# Altium schematic sheet Modules_And_Sensors.SchDoc
size B; SheetNumber: 1; SheetTotal: 2
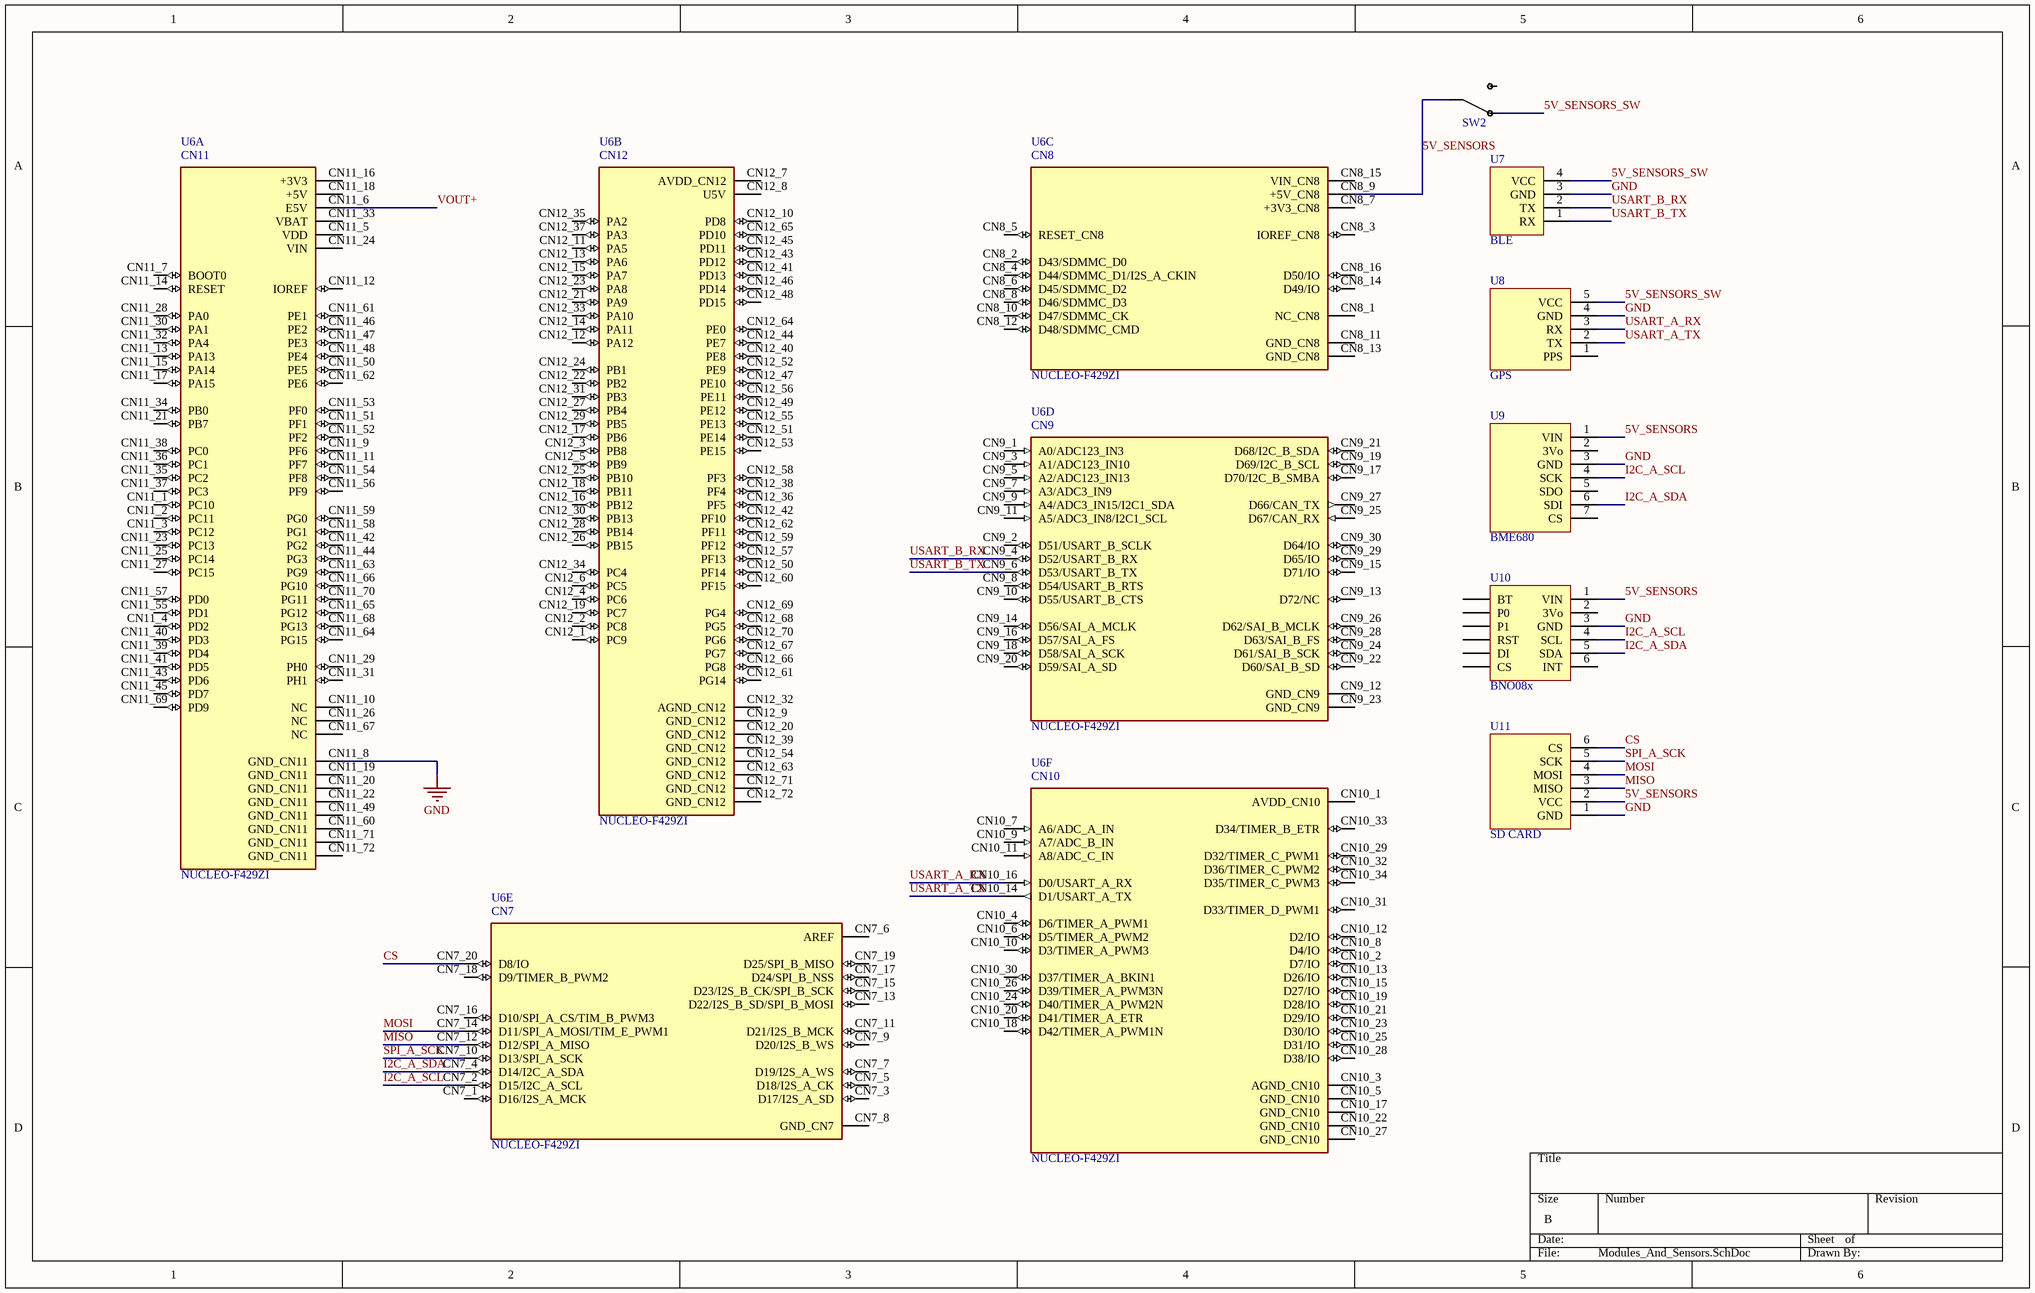
[diagram p0: Modules_And_Sensors.SchDoc]

## Parts
SW2  SW  [SWITCH]  (value not drawn)
U6  NUCLEO-F429ZI  [MODULE_NUCLEO-F429ZI]  (parts A,B,C,D,E,F of 6)
U7  BLE  [BLE]
U8  GPS  [GPS]
U9  BME680  [BME680]
U10  BNO08x  [BNO08x]
U11  SD CARD  [SD CARD]

## Nets
GND: U6.CN11_8(GND_CN11) U7.3(GND) U8.4(GND) U9.3(GND) U10.3(GND) U11.1(GND)
5V_SENSORS: SW2.2 U6.CN8_9(+5V_CN8) U9.1(VIN) U10.1(VIN) U11.2(VCC)
5V_SENSORS_SW: SW2.1 U7.4(VCC) U8.5(VCC)
CS: U6.CN7_20(D8/IO) U11.6(CS)
I2C_A_SCL: U6.CN7_2(D15/I2C_A_SCL) U9.4(SCK) U10.4(SCL)
I2C_A_SDA: U6.CN7_4(D14/I2C_A_SDA) U9.6(SDI) U10.5(SDA)
MISO: U6.CN7_12(D12/SPI_A_MISO) U11.3(MISO)
MOSI: U6.CN7_14(D11/SPI_A_MOSI/TIM_E_PWM1) U11.4(MOSI)
SPI_A_SCK: U6.CN7_10(D13/SPI_A_SCK) U11.5(SCK)
USART_A_RX: U6.CN10_16(D0/USART_A_RX) U8.3(RX)
USART_A_TX: U6.CN10_14(D1/USART_A_TX) U8.2(TX)
USART_B_RX: U6.CN9_4(D52/USART_B_RX) U7.2(TX)
USART_B_TX: U6.CN9_6(D53/USART_B_TX) U7.1(RX)
VOUT+: U6.CN11_6(E5V)

Not connected (* = marked no-connect by the designer): SW2 3(6); U6 CN7_1(D16/I2S_A_MCK) CN7_3(D17/I2S_A_SD) CN7_5(D18/I2S_A_CK) CN7_6(AREF) CN7_7(D19/I2S_A_WS) CN7_8(GND_CN7) CN7_9(D20/I2S_B_WS) CN7_11(D21/I2S_B_MCK) CN7_13(D22/I2S_B_SD/SPI_B_MOSI) CN7_15(D23/I2S_B_CK/SPI_B_SCK) CN7_16(D10/SPI_A_CS/TIM_B_PWM3) CN7_17(D24/SPI_B_NSS) CN7_18(D9/TIMER_B_PWM2) CN7_19(D25/SPI_B_MISO) CN8_1(NC_CN8) CN8_2(D43/SDMMC_D0) CN8_3(IOREF_CN8) CN8_4(D44/SDMMC_D1/I2S_A_CKIN) CN8_5(RESET_CN8) CN8_6(D45/SDMMC_D2) CN8_7(+3V3_CN8) CN8_8(D46/SDMMC_D3) CN8_10(D47/SDMMC_CK) CN8_11(GND_CN8) CN8_12(D48/SDMMC_CMD) CN8_13(GND_CN8) CN8_14(D49/IO) CN8_15(VIN_CN8) CN8_16(D50/IO) CN9_1(A0/ADC123_IN3) CN9_2(D51/USART_B_SCLK) CN9_3(A1/ADC123_IN10) CN9_5(A2/ADC123_IN13) CN9_7(A3/ADC3_IN9) CN9_8(D54/USART_B_RTS) CN9_9(A4/ADC3_IN15/I2C1_SDA) CN9_10(D55/USART_B_CTS) CN9_11(A5/ADC3_IN8/I2C1_SCL) CN9_12(GND_CN9) CN9_13(D72/NC) CN9_14(D56/SAI_A_MCLK) CN9_15(D71/IO) CN9_16(D57/SAI_A_FS) CN9_17(D70/I2C_B_SMBA) CN9_18(D58/SAI_A_SCK) CN9_19(D69/I2C_B_SCL) CN9_20(D59/SAI_A_SD) CN9_21(D68/I2C_B_SDA) CN9_22(D60/SAI_B_SD) CN9_23(GND_CN9) CN9_24(D61/SAI_B_SCK) CN9_25(D67/CAN_RX) CN9_26(D62/SAI_B_MCLK) CN9_27(D66/CAN_TX) CN9_28(D63/SAI_B_FS) CN9_29(D65/IO) CN9_30(D64/IO) CN10_1(AVDD_CN10) CN10_2(D7/IO) CN10_3(AGND_CN10) CN10_4(D6/TIMER_A_PWM1) CN10_5(GND_CN10) CN10_6(D5/TIMER_A_PWM2) CN10_7(A6/ADC_A_IN) CN10_8(D4/IO) CN10_9(A7/ADC_B_IN) CN10_10(D3/TIMER_A_PWM3) CN10_11(A8/ADC_C_IN) CN10_12(D2/IO) CN10_13(D26/IO) CN10_15(D27/IO) CN10_17(GND_CN10) CN10_18(D42/TIMER_A_PWM1N) CN10_19(D28/IO) CN10_20(D41/TIMER_A_ETR) CN10_21(D29/IO) CN10_22(GND_CN10) CN10_23(D30/IO) CN10_24(D40/TIMER_A_PWM2N) CN10_25(D31/IO) CN10_26(D39/TIMER_A_PWM3N) CN10_27(GND_CN10) CN10_28(D38/IO) CN10_29(D32/TIMER_C_PWM1) CN10_30(D37/TIMER_A_BKIN1) CN10_31(D33/TIMER_D_PWM1) CN10_32(D36/TIMER_C_PWM2) CN10_33(D34/TIMER_B_ETR) CN10_34(D35/TIMER_C_PWM3) CN11_1(PC10) CN11_2(PC11) CN11_3(PC12) CN11_4(PD2) CN11_5(VDD) CN11_7(BOOT0) CN11_9(PF6) CN11_10(NC) CN11_11(PF7) CN11_12(IOREF) CN11_13(PA13) CN11_14(RESET) CN11_15(PA14) CN11_16(+3V3) CN11_17(PA15) CN11_18(+5V) CN11_19(GND_CN11) CN11_20(GND_CN11) CN11_21(PB7) CN11_22(GND_CN11) CN11_23(PC13) CN11_24(VIN) CN11_25(PC14) CN11_26(NC) CN11_27(PC15) CN11_28(PA0) CN11_29(PH0) CN11_30(PA1) CN11_31(PH1) CN11_32(PA4) CN11_33(VBAT) CN11_34(PB0) CN11_35(PC2) CN11_36(PC1) CN11_37(PC3) CN11_38(PC0) CN11_39(PD4) CN11_40(PD3) CN11_41(PD5) CN11_42(PG2) CN11_43(PD6) CN11_44(PG3) CN11_45(PD7) CN11_46(PE2) CN11_47(PE3) CN11_48(PE4) CN11_49(GND_CN11) CN11_50(PE5) CN11_51(PF1) CN11_52(PF2) CN11_53(PF0) CN11_54(PF8) CN11_55(PD1) CN11_56(PF9) CN11_57(PD0) CN11_58(PG1) CN11_59(PG0) CN11_60(GND_CN11) CN11_61(PE1) CN11_62(PE6) CN11_63(PG9) CN11_64(PG15) CN11_65(PG12) CN11_66(PG10) CN11_67(NC) CN11_68(PG13) CN11_69(PD9) CN11_70(PG11) CN11_71(GND_CN11) CN11_72(GND_CN11) CN12_1(PC9) CN12_2(PC8) CN12_3(PB8) CN12_4(PC6) CN12_5(PB9) CN12_6(PC5) CN12_7(AVDD_CN12) CN12_8(U5V) CN12_9(GND_CN12) CN12_10(PD8) CN12_11(PA5) CN12_12(PA12) CN12_13(PA6) CN12_14(PA11) CN12_15(PA7) CN12_16(PB12) CN12_17(PB6) CN12_18(PB11) CN12_19(PC7) CN12_20(GND_CN12) CN12_21(PA9) CN12_22(PB2) CN12_23(PA8) CN12_24(PB1) CN12_25(PB10) CN12_26(PB15) CN12_27(PB4) CN12_28(PB14) CN12_29(PB5) CN12_30(PB13) CN12_31(PB3) CN12_32(AGND_CN12) CN12_33(PA10) CN12_34(PC4) CN12_35(PA2) CN12_36(PF5) CN12_37(PA3) CN12_38(PF4) CN12_39(GND_CN12) CN12_40(PE8) CN12_41(PD13) CN12_42(PF10) CN12_43(PD12) CN12_44(PE7) CN12_45(PD11) CN12_46(PD14) CN12_47(PE10) CN12_48(PD15) CN12_49(PE12) CN12_50(PF14) CN12_51(PE14) CN12_52(PE9) CN12_53(PE15) CN12_54(GND_CN12) CN12_55(PE13) CN12_56(PE11) CN12_57(PF13) CN12_58(PF3) CN12_59(PF12) CN12_60(PF15) CN12_61(PG14) CN12_62(PF11) CN12_63(GND_CN12) CN12_64(PE0) CN12_65(PD10) CN12_66(PG8) CN12_67(PG7) CN12_68(PG5) CN12_69(PG4) CN12_70(PG6) CN12_71(GND_CN12) CN12_72(GND_CN12); U8 1(PPS); U9 2(3Vo) 5(SDO) 7(CS); U10 2(3Vo) 6(INT) ?1(CS) ?2(DI) ?3(RST) ?4(P1) ?5(P0) ?6(BT)

## Notes on the sheet
- (in symbol NUCLEO-F429ZI, part A) CN11
- (in symbol NUCLEO-F429ZI, part B) CN12
- (in symbol NUCLEO-F429ZI, part C) CN8
- (in symbol NUCLEO-F429ZI, part D) CN9
- (in symbol NUCLEO-F429ZI, part E) CN7
- (in symbol NUCLEO-F429ZI, part F) CN10

## Library data of the parts
SW2 = Switch
U6 = NUCLEO-F429ZI: STM32F429ZI, mbed-Enabled Development Nucleo-144 STM32F4 ARMÂ® CortexÂ®-M4 MCU 32-Bit Embedded Evaluation Board; MF: STMicroelectronics; Check_prices: https://www.snapeda.com/parts/NUCLEO-F429ZI/STMicroelectronics/view-part/477252/?ref=eda; Availability: Bad; Value: *; Price: None; MP: NUCLEO-F429ZI; SnapEDA_Link: https://www.snapeda.com/parts/NUCLEO-F429ZI/STMicroelectronics/view-part/477252/?ref=snap; Package: None; Purchase-URL: https://pricing.snapeda.com/search/part/NUCLEO-F429ZI/?ref=eda